# EAGLE schematic pic_board (EAGLE 6.1)
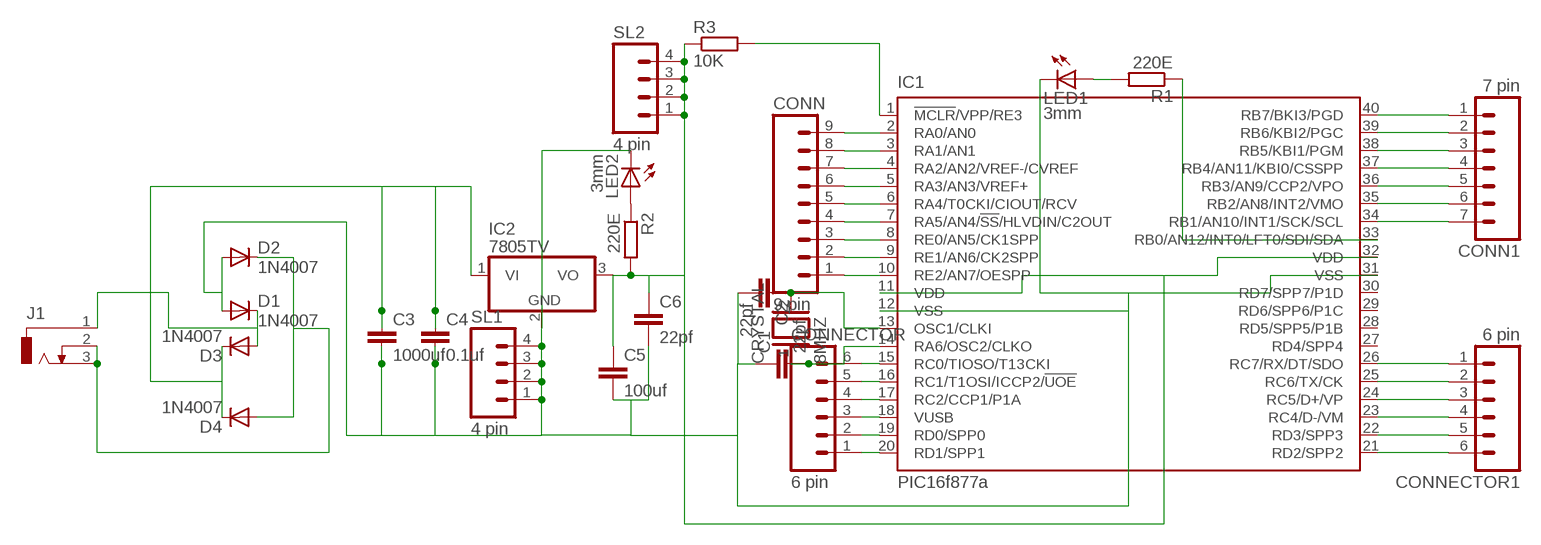
[diagram p0: schematic, sheet 1]

## Parts
C1  22pf  C2.5/2  [C2.5-2]
C2  22pf  C2.5/2  [C2.5-2]
C3  1000uf  C5/7.2  [C5B7.2]
C4  0.1uf  C2,5-3  [C2.5-3]
C5  100uf  C5/7.2  [C5B7.2]
C6  22pf  C2.5/2  [C2.5-2]
CONN  9 pin  M09  [09P]
CONN1  7 pin  M07  [07P]
CONNECTOR  6 pin  M06  [06P]
CONNECTOR1  6 pin  M06  [06P]
CRYSTAL  8MHZ  XTAL/S  [QS]
D1  1N4007  1N4004  [DO41-10]
D2  1N4007  1N4004  [DO41-10]
D3  1N4007  1N4004  [DO41-10]
D4  1N4007  1N4004  [DO41-10]
IC1  PIC16f877a  PIC18F4455_40  [DIL40]
IC2  7805TV  [TO220V]
J1  DCJ0303  [DCJ0303]
LED1  3mm  LED3MM  [LED3MM]
LED2  3mm  LED3MM  [LED3MM]
R1  220E  R-EU_0204/7  [0204/7]
R2  220E  R-EU_0204/7  [0204/7]
R3  10K  R-EU_0204/7  [0204/7]
SL1  4 pin  M04  [04P]
SL2  4 pin  M04  [04P]

## Nets
N$1: C2.1 CRYSTAL.2 IC1.13(OSC1/CLKI)
N$2: C1.2 CRYSTAL.1 IC1.14(RA6/OSC2/CLKO)
N$3: LED1.A R1.2
N$4: CONN.1 IC1.10(RE2/AN7/OESPP)
N$5: CONN.2 IC1.9(RE1/AN6/CK2SPP)
N$6: CONN.3 IC1.8(RE0/AN5/CK1SPP)
N$7: CONN.4 IC1.7(RA5/AN4/!SS!/HLVDIN/C2OUT)
N$8: CONN.5 IC1.6(RA4/T0CKI/CIOUT/RCV)
N$9: CONN.6 IC1.5(RA3/AN3/VREF+)
N$10: CONN.7 IC1.4(RA2/AN2/VREF-/CVREF)
N$11: CONN.8 IC1.3(RA1/AN1)
N$12: CONN.9 IC1.2(RA0/AN0)
N$13: CONNECTOR.1 IC1.20(RD1/SPP1)
N$14: CONNECTOR.2 IC1.19(RD0/SPP0)
N$15: CONNECTOR.3 IC1.18(VUSB)
N$16: CONNECTOR.4 IC1.17(RC2/CCP1/P1A)
N$17: CONNECTOR.5 IC1.16(RC1/T1OSI/ICCP2/!UOE)
N$18: CONNECTOR.6 IC1.15(RC0/TIOSO/T13CKI)
N$19: CONN1.1 IC1.40(RB7/BKI3/PGD)
N$20: CONN1.2 IC1.39(RB6/KBI2/PGC)
N$21: CONN1.3 IC1.38(RB5/KBI1/PGM)
N$22: CONN1.4 IC1.37(RB4/AN11/KBI0/CSSPP)
N$23: CONN1.5 IC1.36(RB3/AN9/CCP2/VPO)
N$24: CONN1.6 IC1.35(RB2/AN8/INT2/VMO)
N$25: CONN1.7 IC1.34(RB1/AN10/INT1/SCK/SCL)
N$26: CONNECTOR1.1 IC1.26(RC7/RX/DT/SDO)
N$27: CONNECTOR1.2 IC1.25(RC6/TX/CK)
N$28: CONNECTOR1.3 IC1.24(RC5/D+/VP)
N$29: IC1.33(RB0/AN12/INT0/LFT0/SDI/SDA) R1.1
N$30: C3.1 C4.1 D3.C D4.C IC2.1(VI)
N$31: D2.C D4.A J1.2 J1.3
N$32: D1.C D3.A J1.1
N$33: C5.1 C6.1 IC1.11(VDD) IC1.32(VDD) IC2.3(VO) R2.2 R3.1 SL2.1 SL2.2 SL2.3 SL2.4
N$34: LED2.A R2.1
N$35: C1.1 C2.2 C3.2 C4.2 C5.2 C6.2 D1.A D2.A IC1.12(VSS) IC1.31(VSS) IC2.2(GND) LED1.K(C) LED2.K(C) SL1.1 SL1.2 SL1.3 SL1.4
N$36: CONNECTOR1.4 IC1.23(RC4/D-/VM)
N$37: CONNECTOR1.5 IC1.22(RD3/SPP3)
N$38: CONNECTOR1.6 IC1.21(RD2/SPP2)
N$39: IC1.1(!MCLR!/VPP/RE3) R3.2
Unconnected: IC1.27(RD4/SPP4) IC1.28(RD5/SPP5/P1B) IC1.29(RD6/SPP6/P1C) IC1.30(RD7/SPP7/P1D)

## Library data of the parts
C1-C6 = capacitor-wima:C: CAPACITOR naming: grid - package width
CONN = con-amp-quick:M09: AMP QUICK CONNECTOR; OC_FARNELL: unknown; OC_NEWARK: unknown
CONN1 = con-amp-quick:M07: AMP QUICK CONNECTOR; OC_FARNELL: unknown; OC_NEWARK: unknown
CONNECTOR CONNECTOR1 = con-amp-quick:M06: AMP QUICK CONNECTOR; OC_FARNELL: unknown; OC_NEWARK: unknown
CRYSTAL = special:XTAL/S: CRYSTAL
D1-D4 = diode:1N4004: DIODE general purpose rectifier, 1 A
IC1 = microchip:PIC18F4*_40: USB Microcontrollers with nanoWatt Technology High-Performance, Enhanced Flash, 28/40/44-Pin, Source: http://ww1.microchip.com/downloads/en/devicedoc/39632c.pdf; MF: MICROCHIP; MPN: PIC18F4455-I/P; OC_FARNELL: 9321314; OC_NEWARK: 05K2028
IC2 = linear:78*: Positive VOLTAGE REGULATOR Source: http://cache.national.com/ds/LM/LM78L05.pdf http://www.fairchildsemi.com/ds/LM/LM7805.pdf
J1 = con-jack:DCJ0303: DC POWER JACK Source: DCJ0303.pdf; OC_FARNELL: unknown; OC_NEWARK: unknown
LED1 LED2 = led:LED: LED OSRAM: - CHIPLED LG R971, LG N971, LY N971, LG Q971, LY Q971, LO R971, LY R971 LH N974, LH R974 LS Q976, LO Q976, LY Q976 LO Q996 - Hyper CHIPLED LW Q18S LB Q993, LB Q99A, LB R99A - SideLED LS A670, LO A670, LY A670, LG A670, LP A670 LB A673, LV A673, LT A673, LW A673 LH A674 LY A675 LS A676, LA A676, LO A676, LY A676, LW A676 LS A679, LY A679, LG A679 - Hyper Micro SIDELED® LS Y876, LA Y876, LO Y876, LY Y876 LT Y87S - SmartLED LW L88C, LW L88S LB L89C, LB L89S, LG L890 LS L89K, LO L89K, LY L89K LS L896, LA L896, LO L896, LY L896 - TOPLED LS T670, LO T670, LY T670, LG T670, LP T670 LSG T670, LSP T670, LSY T670, LOP T670, LYG T670 LG T671, LOG T671, LSG T671 LB T673, LV T673, LT T673, LW T673 LH T674 LS T676, LA T676, LO T676, LY T676, LB T676, LH T676, LSB T676, LW T676 LB T67C, LV T67C, LT T67C, LS T67K, LO T67K, LY T67K, LW E67C LS E67B, LA E67B, LO E67B, LY E67B, LB E67C, LV E67C, LT E67C LW T67C LS T679, LY T679, LG T679 LS T770, LO T770, LY T770, LG T770, LP T770 LB T773, LV T773, LT T773, LW T773 LH T774 LS E675, LA E675, LY E675, LS T675 LS T776, LA T776, LO T776, LY T776, LB T776 LHGB T686 LT T68C, LB T68C - Hyper Mini TOPLED® LB M676 - Mini TOPLED Santana® LG M470 LS M47K, LO M47K, LY M47K Source: http://www.osram.convergy.de LUXEON: - LUMILED® LXK2-PW12-R00, LXK2-PW12-S00, LXK2-PW14-U00, LXK2-PW14-V00 LXK2-PM12-R00, LXK2-PM12-S00, LXK2-PM14-U00 LXK2-PE12-Q00, LXK2-PE12-R00, LXK2-PE12-S00, LXK2-PE14-T00, LXK2-PE14-U00 LXK2-PB12-K00, LXK2-PB12-L00, LXK2-PB12-M00, LXK2-PB14-N00, LXK2-PB14-P00, LXK2-PB14-Q00 LXK2-PR12-L00, LXK2-PR12-M00, LXK2-PR14-Q00, LXK2-PR14-R00 LXK2-PD12-Q00, LXK2-PD12-R00, LXK2-PD12-S00 LXK2-PH12-R00, LXK2-PH12-S00 LXK2-PL12-P00, LXK2-PL12-Q00, LXK2-PL12-R00 Source: www.luxeon.com KINGBRIGHT: KA-3528ASYC Source: www.kingbright.com
R1-R3 = rcl:R-EU_: RESISTOR, European symbol
SL1 SL2 = con-amp-quick:M04: AMP QUICK CONNECTOR; OC_FARNELL: unknown; OC_NEWARK: unknown